# EasyEDA schematic power.json
TITLE: Power subsystem; REV: 1.0; Date: 2025-10-04; Sheet: 1/1; Drawn By: guayacansebastian; Company: Chiwinners
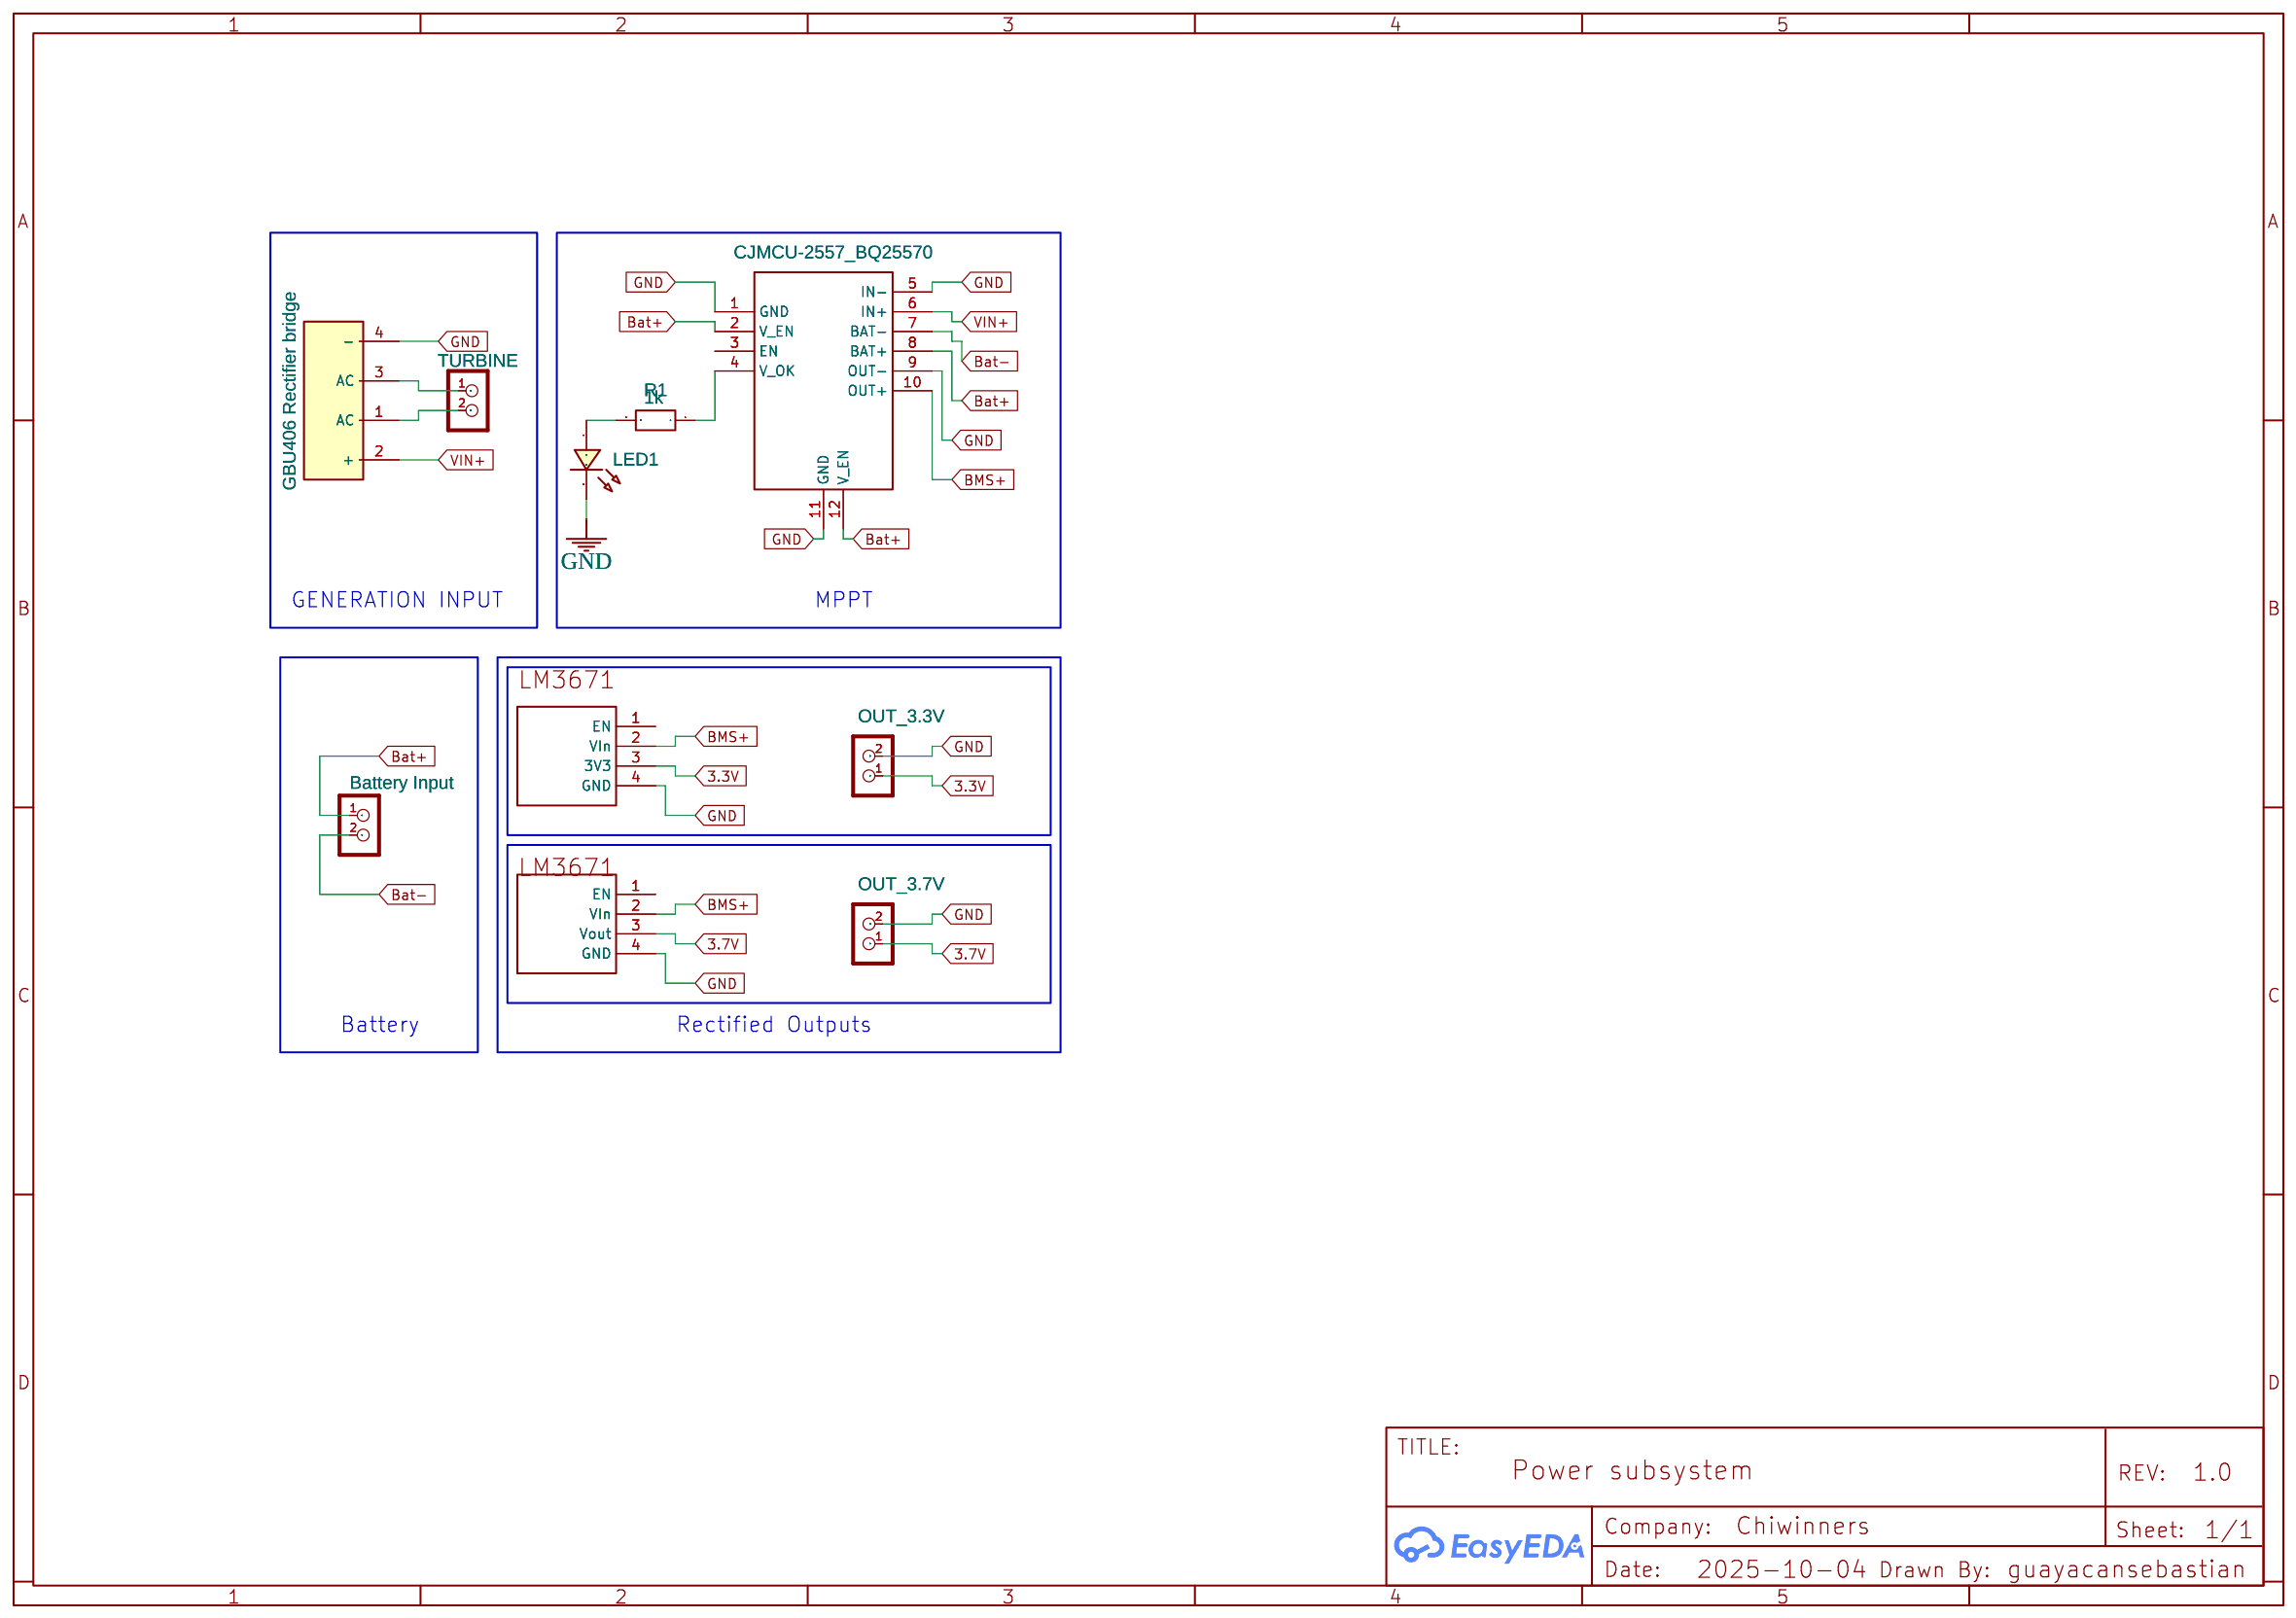
[diagram p0: schematic sheet]

## Parts
BATTERY  Battery Input  [TERMINAL_BLOCK_2P_5]
DB1  GBU406 Rectifier bridge  [DIO-BG-TH_GBU406]
J3  OUT_3.3V  [TERMINAL_BLOCK_2P_5]
LED1  LED-0603_R  [LED0603_RED]
OUT_3  OUT_3.7V  [TERMINAL_BLOCK_2P_5]  (section 7)
R1  1k  [R0603]
TURBINE  CON_TERMINAL_BLOCK_02  [TERMINAL_BLOCK_2P_5]
U1  CJMCU-2557_BQ25570  [BQ25570]
U2  LM3671  [LM3671]
U3  LM3671  [LM3671]

## Library data of the parts
BATTERY J3 OUT_3 TURBINE = CON_TERMINAL_BLOCK_02: Contributor: DangerousPrototype
DB1 = GBU406 Rectifier bridge: Supplier: LCSC; Manufacturer: MDD(辰达半导体); Manufacturer Part: GBU406; Supplier Part: C13432; JLCPCB Part Class: Extended Part
LED1 = LED-0603_R: Manufacturer: EVERLIGHT(台湾亿光); Manufacturer Part: 19-217/R6C-AL1M2VY/3T; Supplier Part: C72044; Supplier: LCSC; Contributor: LCEDA_01
R1 = R_0603_EU: Contributor: LCEDA_Lib
U1 = CJMCU-2557_BQ25570_BREAKOUT_CSTOR: Supplier: LCSC; Manufacturer: ReliaPro; Manufacturer Part: Headers  Pins 1*4P; image: http://image.lceda.cn/szlcsc/C59481.jpg; Supplier Part: C59481; Contributor: alehramanovich
U2 U3 = LM3671: Contributor: Lberquez

## Nets
3.3V: J3.1 U2.3(3V3)
3.7V: OUT_3.1 U3.3(Vout)
GND: DB1.4(-) J3.2 LED1.2 OUT_3.2 U1.1(GND) U1.5(IN-) U1.9(OUT-) U1.11(GND) U2.4(GND) U3.4(GND)
VIN+: DB1.2(+) U1.6(IN+)
Bat+: BATTERY.1 U1.2(V_EN) U1.8(BAT+) U1.12(V_EN)
Bat-: BATTERY.2 U1.7(BAT-)
BMS+: U1.10(OUT+) U2.2(VIn) U3.2(VIn)
Net-(DB1-1): DB1.1(AC) TURBINE.2
Net-(DB1-3): DB1.3(AC) TURBINE.1
Net-(LED1-1): LED1.1 R1.2
Net-(R1-1): R1.1 U1.4(V_OK)

Not connected (* = marked no-connect by the designer): U1 3(EN); U2 1(EN); U3 1(EN)

## Notes on the sheet
- GENERATION INPUT
- MPPT
- Battery
- Rectified Outputs
